# EAGLE design AccelRecorder (EAGLE 6.5.0)

## Sheet 1 of 2
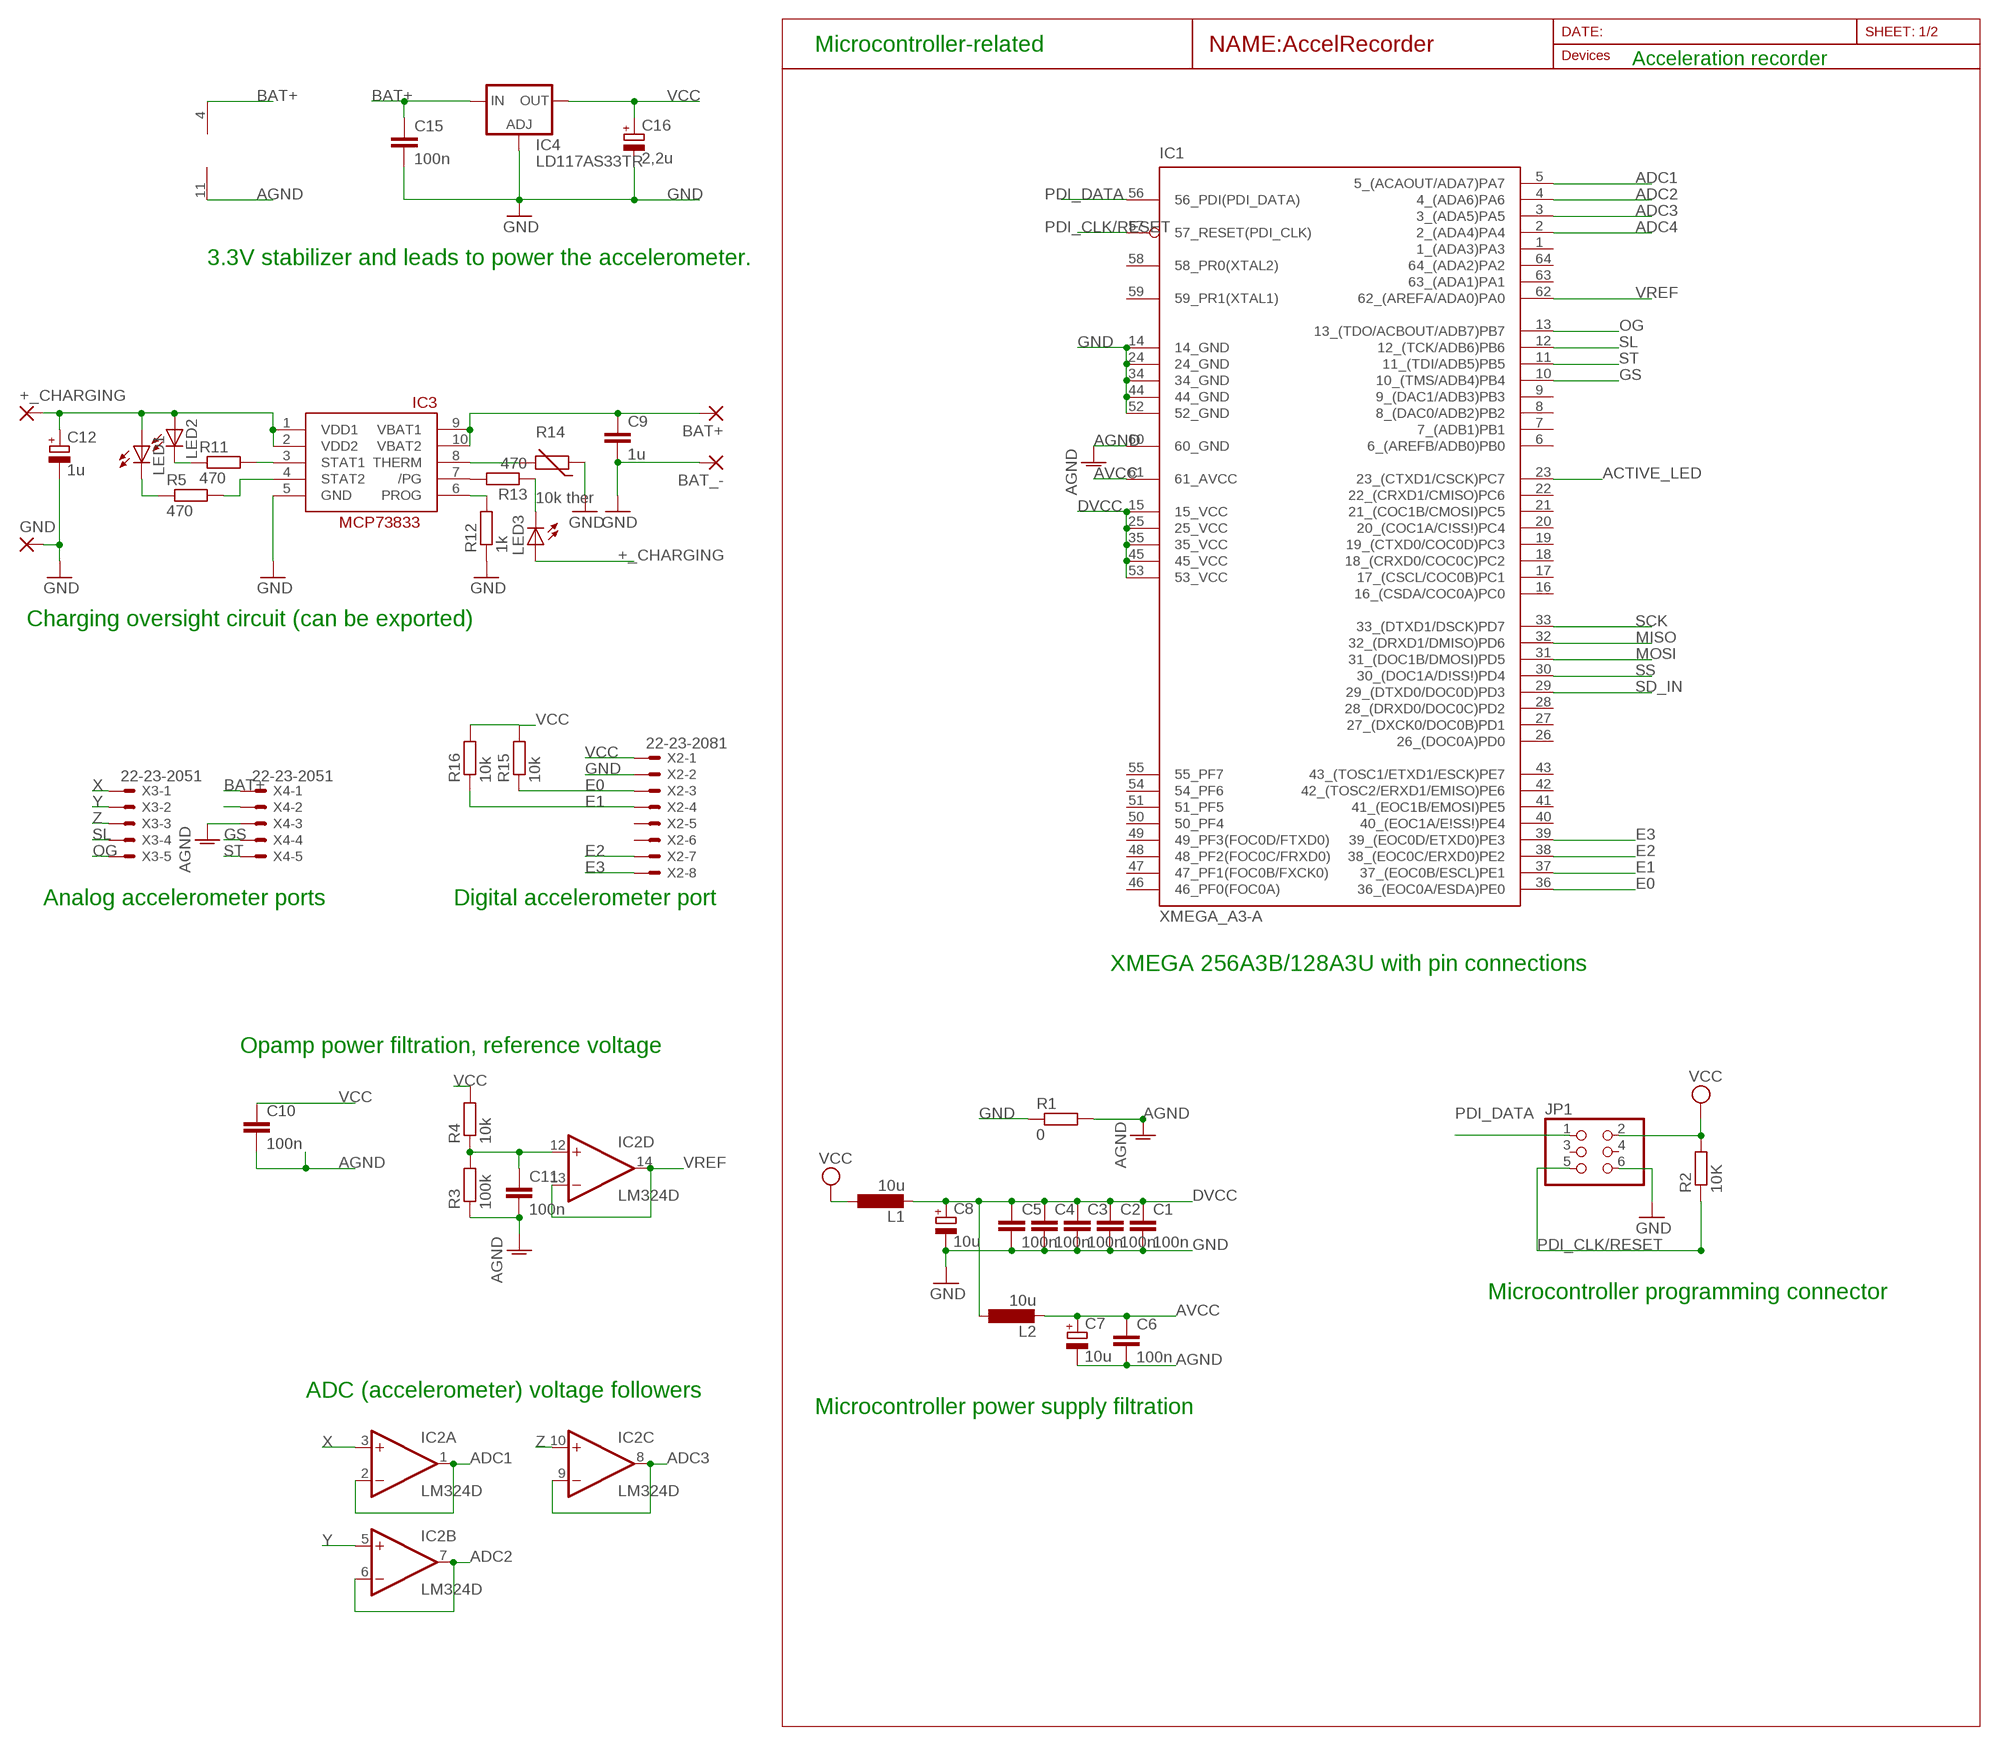
[diagram p0: schematic, sheet 1]

### Parts
+_CHARGING  SMD2  [SMD1,27-2,54]
BAT+  SMD2  [SMD1,27-2,54]
BAT_-  SMD2  [SMD1,27-2,54]
C1  100n  C-EUC0805K  [C0805K]
C2  100n  C-EUC0805K  [C0805K]
C3  100n  C-EUC0805K  [C0805K]
C4  100n  C-EUC0805K  [C0805K]
C5  100n  C-EUC0805K  [C0805K]
C6  100n  C-EUC0805K  [C0805K]
C7  10u  CPOL-EUSANYO_SMD_B6  [SANYO-OSCON_SMD_B6]
C8  10u  CPOL-EUSANYO_SMD_B6  [SANYO-OSCON_SMD_B6]
C9  1u  C-EUC1206  [C1206]
C10  100n  C-EUC0805  [C0805]
C11  100n  C-EUC0805  [C0805]
C12  1u  CPOL-EUSANYO_SMD_B6  [SANYO-OSCON_SMD_B6]
C15  100n  C-EUC0805K  [C0805K]
C16  2,2u  CPOL-EUSANYO_SMD_B6  [SANYO-OSCON_SMD_B6]
GND  SMD2  [SMD1,27-2,54]
IC1  XMEGA_A3-A  [TQFP64]
IC2  LM324D  [SO14]
IC3  MCP73833-UN  [MSOP10]
IC4  LD117AS33TR  [SOT223]
JP1  PINHD-2X3  [2X03]
L1  10u  L-EUL3225M  [L3225M]
L2  10u  L-EUL3225M  [L3225M]
LED1  LED3MM  [LED3MM]
LED2  LED3MM  [LED3MM]
LED3  LED3MM  [LED3MM]
R1  0  R-EU_M1206  [M1206]
R2  10K  R-EU_M1206  [M1206]
R3  100k  R-EU_M1206  [M1206]
R4  10k  R-EU_M1206  [M1206]
R5  470  R-EU_R0805  [R0805]
R11  470  R-EU_R0805  [R0805]
R12  1k  R-EU_R0805  [R0805]
R13  470  R-EU_R0805  [R0805]
R14  10k ther  THERMISTOR-2,5  [RS-2,5]
R15  10k  R-EU_M1206  [M1206]
R16  10k  R-EU_M1206  [M1206]
X2  22-23-2081  [22-23-2081]
X3  22-23-2051  [22-23-2051]
X4  22-23-2051  [22-23-2051]

### Nets
+_CHARGING: +_CHARGING.1(P) C12.+ IC3.1(VDD1) IC3.2(VDD2) LED1.A LED2.A LED3.A
ACTIVE_LED: IC1.23(23_(CTXD1/CSCK)PC7) ; also sheet 2
ADC1: IC1.5(5_(ACAOUT/ADA7)PA7) IC2.1(A:OUT) IC2.2(A:-IN)
ADC2: IC1.4(4_(ADA6)PA6) IC2.6(B:-IN) IC2.7(B:OUT)
ADC3: IC1.3(3_(ADA5)PA5) IC2.8(C:OUT) IC2.9(C:-IN)
ADC4: IC1.2(2_(ADA4)PA4)
AGND: C6.2 C7.- C10.2 C11.2 IC1.60(60_GND) IC2.11(P:V-) R1.2 R3.1 X4.3
AVCC: C6.1 C7.+ IC1.61(61_AVCC) L2.2
BAT+: BAT+.1(P) C9.1 C15.1 IC2.4(P:V+) IC3.9(VBAT1) IC3.10(VBAT2) IC4.3(IN) X4.1
DVCC: C1.1 C2.1 C3.1 C4.1 C5.1 C8.+ IC1.15(15_VCC) IC1.25(25_VCC) IC1.35(35_VCC) IC1.45(45_VCC) IC1.53(53_VCC) L1.2 L2.1
E0: IC1.36(36_(EOC0A/ESDA)PE0) R15.1 X2.3
E1: IC1.37(37_(EOC0B/ESCL)PE1) R16.1 X2.4
E2: IC1.38(38_(EOC0C/ERXD0)PE2) X2.7
E3: IC1.39(39_(EOC0D/ETXD0)PE3) X2.8
GND: BAT_-.1(P) C1.2 C2.2 C3.2 C4.2 C5.2 C8.- C9.2 C12.- C15.2 C16.- GND.1(P) IC1.14(14_GND) IC1.24(24_GND) IC1.34(34_GND) IC1.44(44_GND) IC1.52(52_GND) IC3.5(GND) IC4.1(ADJ) JP1.6 R1.1 R12.1 R14.1 X2.2 ; also sheet 2
GS: IC1.10(10_(TMS/ADB4)PB4) X4.4
MISO: IC1.32(32_(DRXD1/DMISO)PD6) ; also sheet 2
MOSI: IC1.31(31_(DOC1B/DMOSI)PD5) ; also sheet 2
N$3: IC3.7(/PG) R13.2
N$6: LED3.K(C) R13.1
N$7: IC3.3(STAT1) R11.2
N$8: LED2.K(C) R11.1
N$9: C11.1 IC2.12(D:+IN) R3.2 R4.1
N$10: IC3.6(PROG) R12.2
N$11: IC3.8(THERM) R14.2
N$12: LED1.K(C) R5.1
N$13: IC3.4(STAT2) R5.2
N$17: X4.2
OG: IC1.13(13_(TDO/ACBOUT/ADB7)PB7) X3.5
PDI_CLK/RESET: IC1.57(57_RESET(PDI_CLK)) JP1.5 R2.1
PDI_DATA: IC1.56(56_PDI(PDI_DATA)) JP1.1
SCK: IC1.33(33_(DTXD1/DSCK)PD7) ; also sheet 2
SD_IN: IC1.29(29_(DTXD0/DOC0D)PD3) ; also sheet 2
SL: IC1.12(12_(TCK/ADB6)PB6) X3.4
SS: IC1.30(30_(DOC1A/D\!SS\!)PD4) ; also sheet 2
ST: IC1.11(11_(TDI/ADB5)PB5) X4.5
VCC: C10.1 C16.+ IC4.4(OUT) JP1.2 L1.1 R2.2 R4.2 R15.2 R16.2 X2.1 ; also sheet 2
VREF: IC1.62(62_(AREFA/ADA0)PA0) IC2.13(D:-IN) IC2.14(D:OUT)
X: IC2.3(A:+IN) X3.1
Y: IC2.5(B:+IN) X3.2
Z: IC2.10(C:+IN) X3.3
Unconnected: IC1.1(1_(ADA3)PA3) IC1.6(6_(AREFB/ADB0)PB0) IC1.7(7_(ADB1)PB1) IC1.8(8_(DAC0/ADB2)PB2) IC1.9(9_(DAC1/ADB3)PB3) IC1.16(16_(CSDA/COC0A)PC0) IC1.17(17_(CSCL/COC0B)PC1) IC1.18(18_(CRXD0/COC0C)PC2) IC1.19(19_(CTXD0/COC0D)PC3) IC1.20(20_(COC1A/C\!SS\!)PC4) IC1.21(21_(COC1B/CMOSI)PC5) IC1.22(22_(CRXD1/CMISO)PC6) IC1.26(26_(DOC0A)PD0) IC1.27(27_(DXCK0/DOC0B)PD1) IC1.28(28_(DRXD0/DOC0C)PD2) IC1.40(40_(EOC1A/E\!SS\!)PE4) IC1.41(41_(EOC1B/EMOSI)PE5) IC1.42(42_(TOSC2/ERXD1/EMISO)PE6) IC1.43(43_(TOSC1/ETXD1/ESCK)PE7) IC1.46(46_PF0(FOC0A)) IC1.47(47_PF1(FOC0B/FXCK0)) IC1.48(48_PF2(FOC0C/FRXD0)) IC1.49(49_PF3(FOC0D/FTXD0)) IC1.50(50_PF4) IC1.51(51_PF5) IC1.54(54_PF6) IC1.55(55_PF7) IC1.58(58_PR0(XTAL2)) IC1.59(59_PR1(XTAL1)) IC1.63(63_(ADA1)PA1) IC1.64(64_(ADA2)PA2) JP1.3 JP1.4 X2.5 X2.6

### Notes on the sheet
- Microcontroller-related
- Acceleration recorder
- 3.3V stabilizer and leads to power the accelerometer.
- Charging oversight circuit (can be exported)
- Analog accelerometer ports | Digital accelerometer port
- XMEGA 256A3B/128A3U with pin connections
- Opamp power filtration, reference voltage
- Microcontroller programming connector
- ADC (accelerometer) voltage followers
- Microcontroller power supply filtration

## Sheet 2 of 2
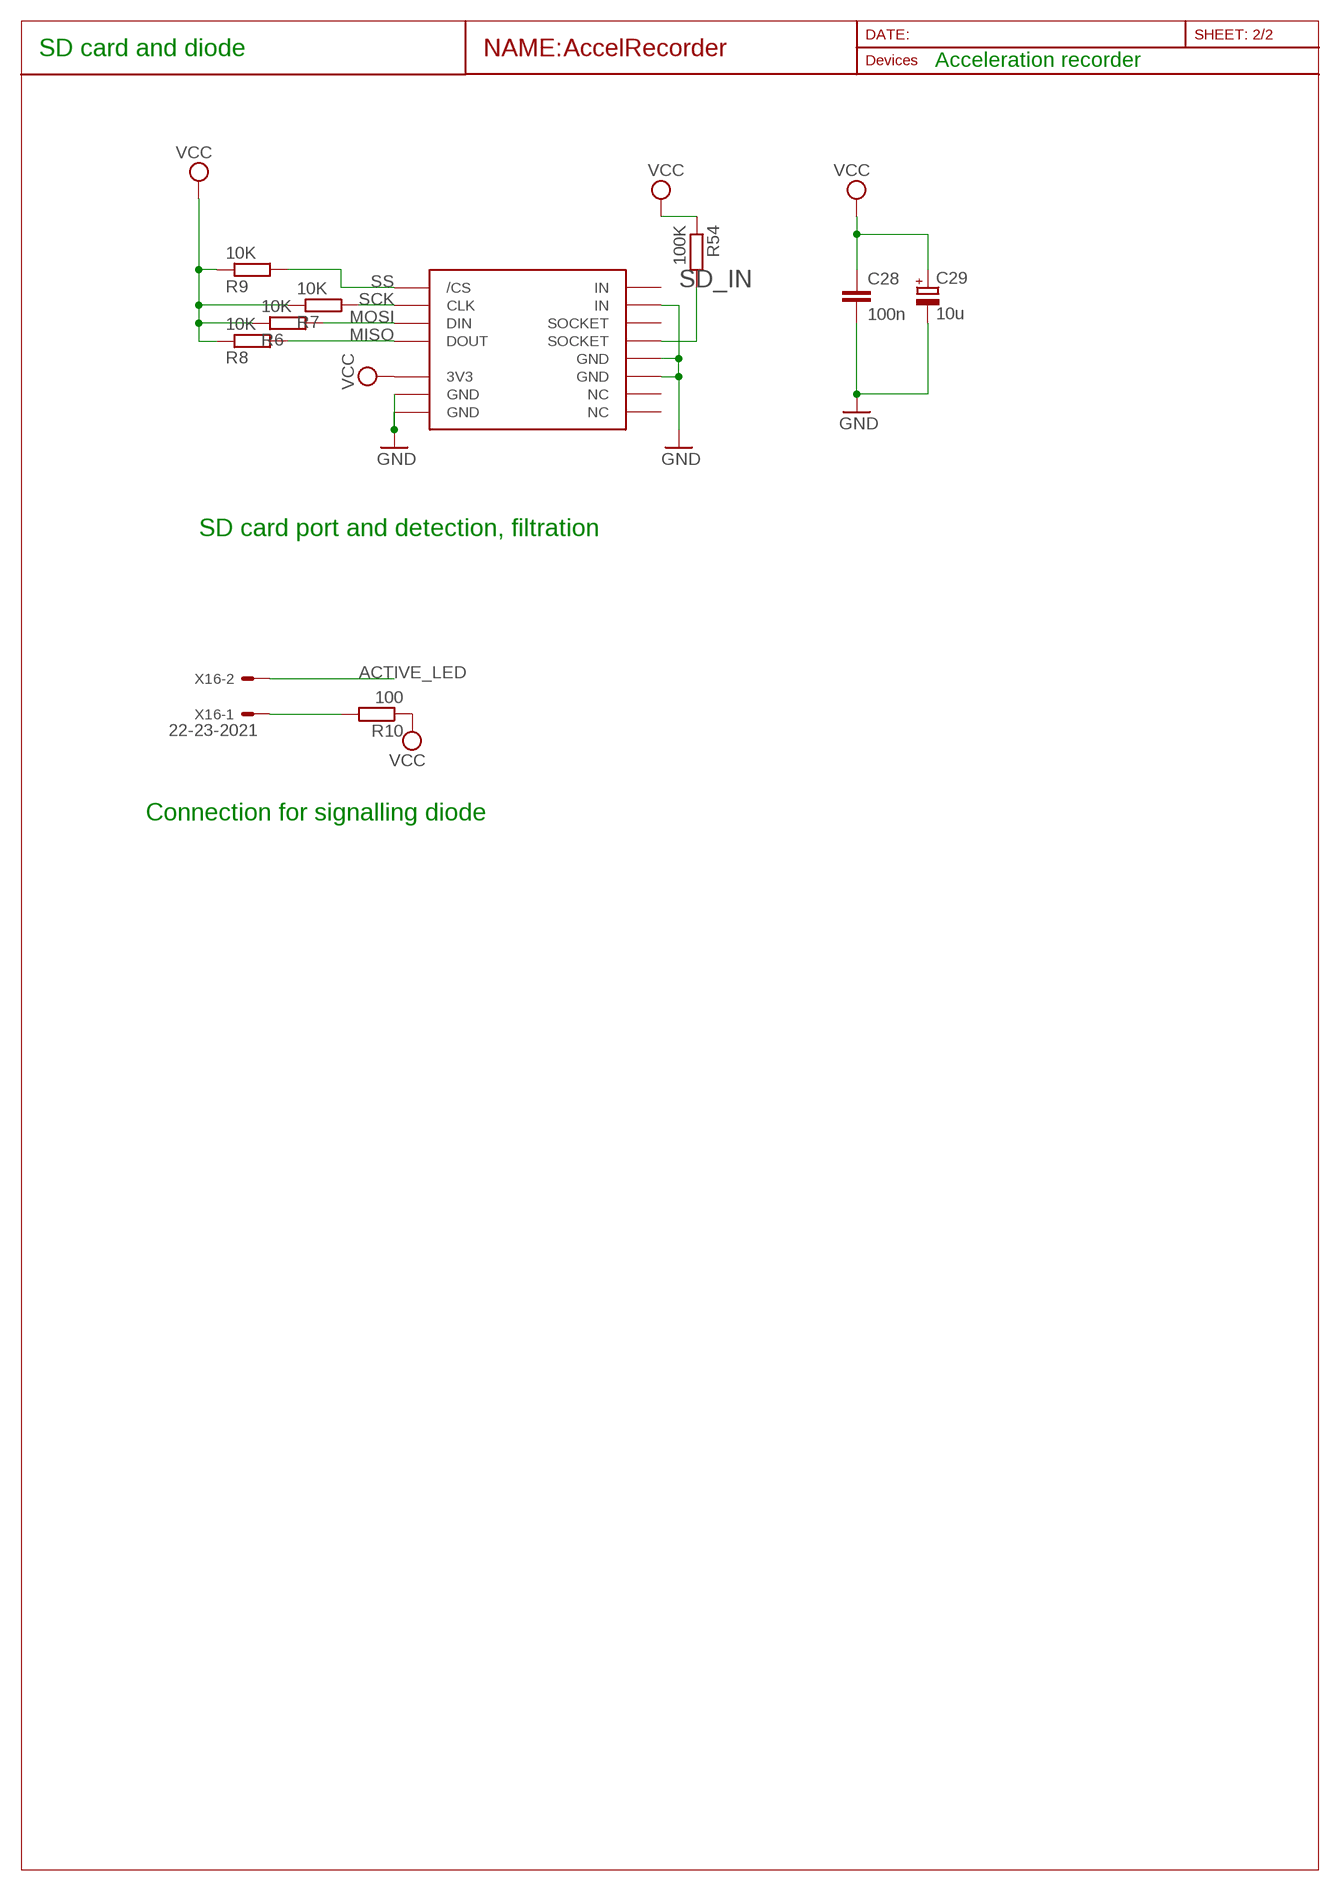
[diagram p1: schematic, sheet 2]

### Parts
C28  100n  C-EUC0805K  [C0805K]
C29  10u  CPOL-EUSANYO_SMD_B6  [SANYO-OSCON_SMD_B6]
R6  10K  R-EU_M1206  [M1206]
R7  10K  R-EU_M1206  [M1206]
R8  10K  R-EU_M1206  [M1206]
R9  10K  R-EU_M1206  [M1206]
R10  100  R-EU_M1206  [M1206]
R54  100K  R-EU_M1206  [M1206]
U$1  MMC  [MMC_SOCKET]
X16  22-23-2021  [22-23-2021]

### Nets
ACTIVE_LED: X16.2 ; also sheet 1
GND: C28.2 C29.- U$1.GND@1(GND) U$1.GND@2(GND) U$1.GND@3(GND) U$1.GND@4(GND) U$1.IN@2(IN) ; also sheet 1
MISO: R8.2 U$1.DOUT ; also sheet 1
MOSI: R6.2 U$1.DIN ; also sheet 1
N$4: R10.2 X16.1
SCK: R7.2 U$1.CLK ; also sheet 1
SD_IN: R54.2 U$1.P$2(SOCKET) ; also sheet 1
SS: R9.2 U$1./CS ; also sheet 1
VCC: C28.1 C29.+ R6.1 R7.1 R8.1 R9.1 R10.1 R54.1 U$1.3V3 ; also sheet 1
Unconnected: U$1.IN@1(IN) U$1.NC@1(NC) U$1.NC@2(NC) U$1.P$1(SOCKET)

### Notes on the sheet
- SD card and diode
- Acceleration recorder
- SD card port and detection, filtration
- Connection for signalling diode

## Library data of the parts
+_CHARGING BAT+ BAT_- GND = wirepad:SMD2: SMD PAD
C1-C6 C9-C11 C15 C28 = rcl:C-EU: CAPACITOR, European symbol
C7 C8 C12 C16 C29 = rcl:CPOL-EU: POLARIZED CAPACITOR, European symbol
IC1 = xmega_a3:XMEGA_A3: MICROCONTROLLER 64-256 Kbytes FLASH 4-16 Kbytes SRAM 2-4 Kbytes EEPROM DMA Controller and Event System 2 8-channel 12 bit ADC, 1 2-channel 12bit DAC 7 USART, 2 TWI, 3 SPI AES and DES Crypto Engine Source: xmega_a3.lbr
IC2 = linear:LM324: OP AMP
IC3 = adafruit:MCP73833
IC4 = v-reg:LD117A?*: Low drop fixed and adjustable positive voltage regulators 1 A Source: http://www.st.com/stonline/products/literature/ds/7194/ld1117axx.pdf
JP1 = pinhead:PINHD-2X3: PIN HEADER
L1 L2 = rcl:L-EU: INDUCTOR, European symbol
LED1-LED3 = SparkFunEagle-6-6-07:LED: LEDs Standard schematic elements and footprints for 5mm, 3mm, 1206, and 0603 sized LEDs. 5mm - Spark Fun Electronics SKU : COM-00529 (and others)
R1-R4 R6-R10 R15 R16 R54 = resistor:R-EU_: RESISTOR, European symbol
R5 R11-R13 = rcl:R-EU_: RESISTOR, European symbol
R14 = varistor:THERMISTOR: THERMISTOR
U$1 = SD:MMC
X2 = con-molex:22-23-2081: .100" (2.54mm) Center Header - 8 Pin; MF: MOLEX; MPN: 22-23-2081; OC_FARNELL: 1756826; OC_NEWARK: 01C7592
X3 X4 = con-molex:22-23-2051: .100" (2.54mm) Center Header - 5 Pin; MF: MOLEX; MPN: 22-23-2051; OC_FARNELL: 1462952; OC_NEWARK: 38C9178
X16 = con-molex:22-23-2021: .100" (2.54mm) Center Header - 2 Pin; MF: MOLEX; MPN: 22-23-2021; OC_FARNELL: 1462926; OC_NEWARK: 25C3832

## Net classes
0 default: width 0.013 mm, drill 1 mm

## Board
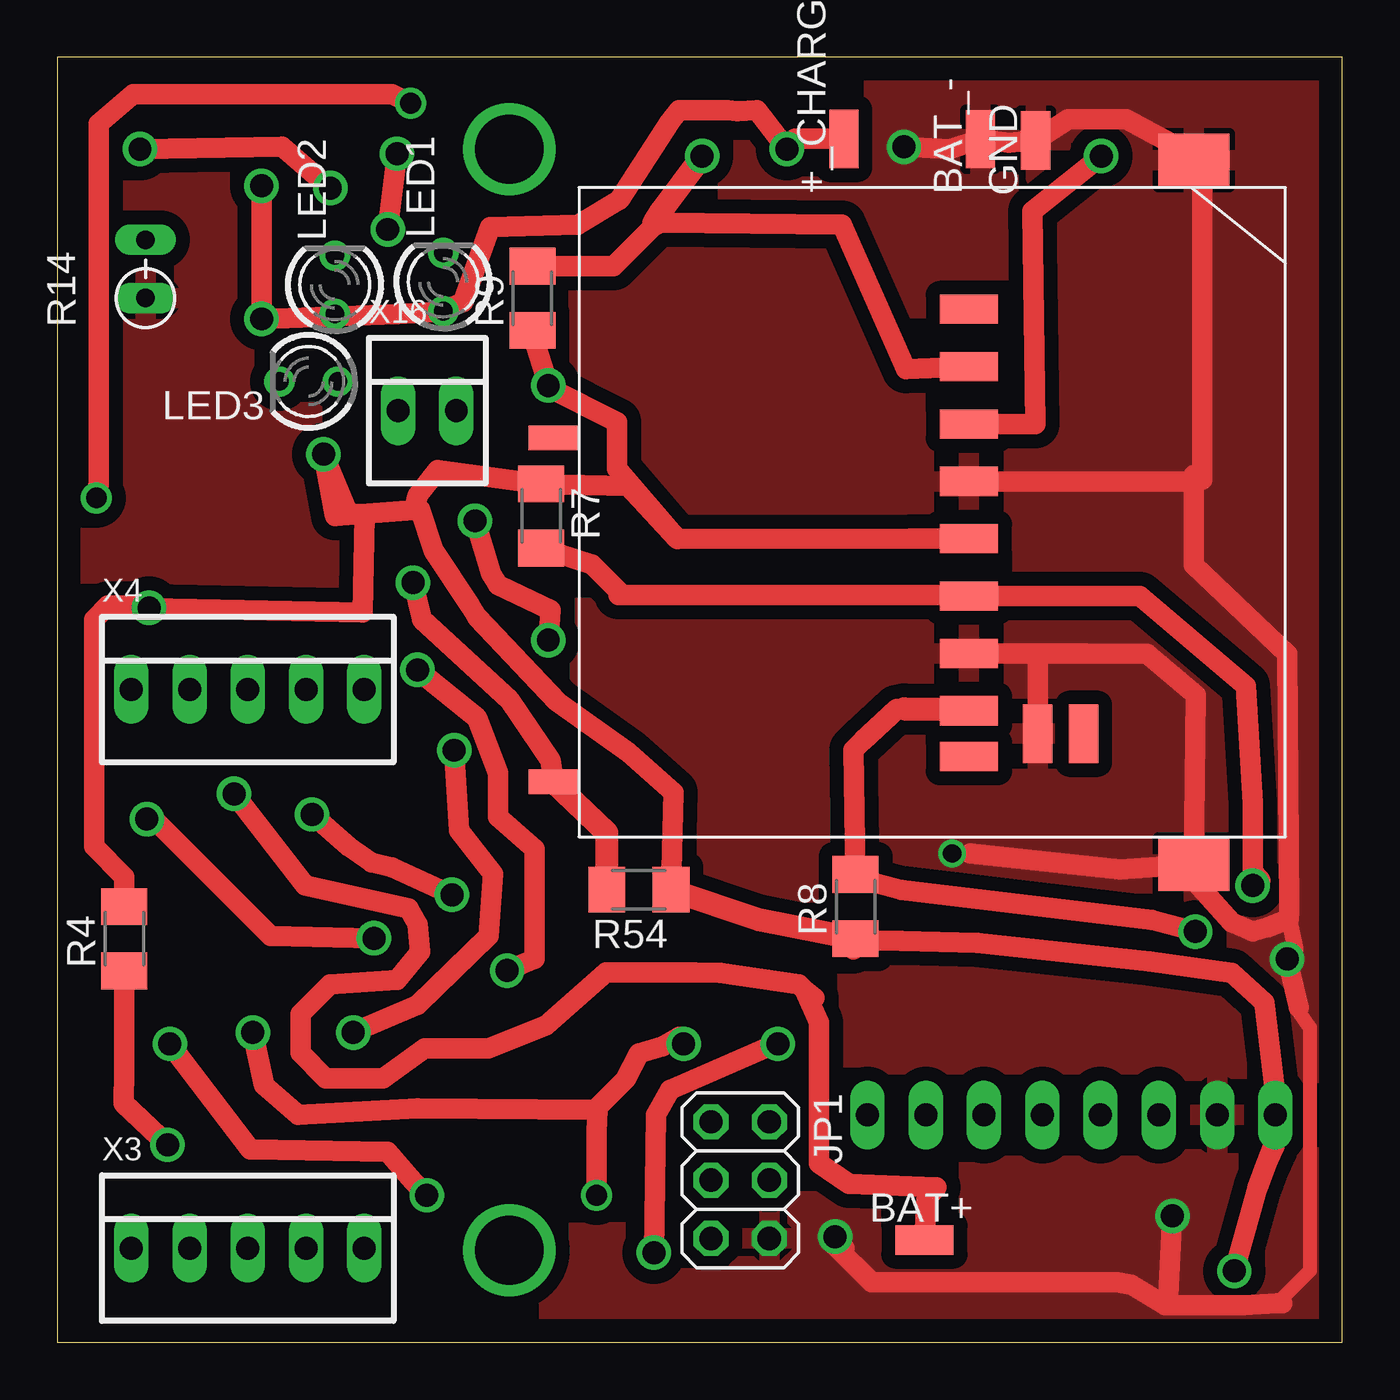
[diagram p2: board, top side]
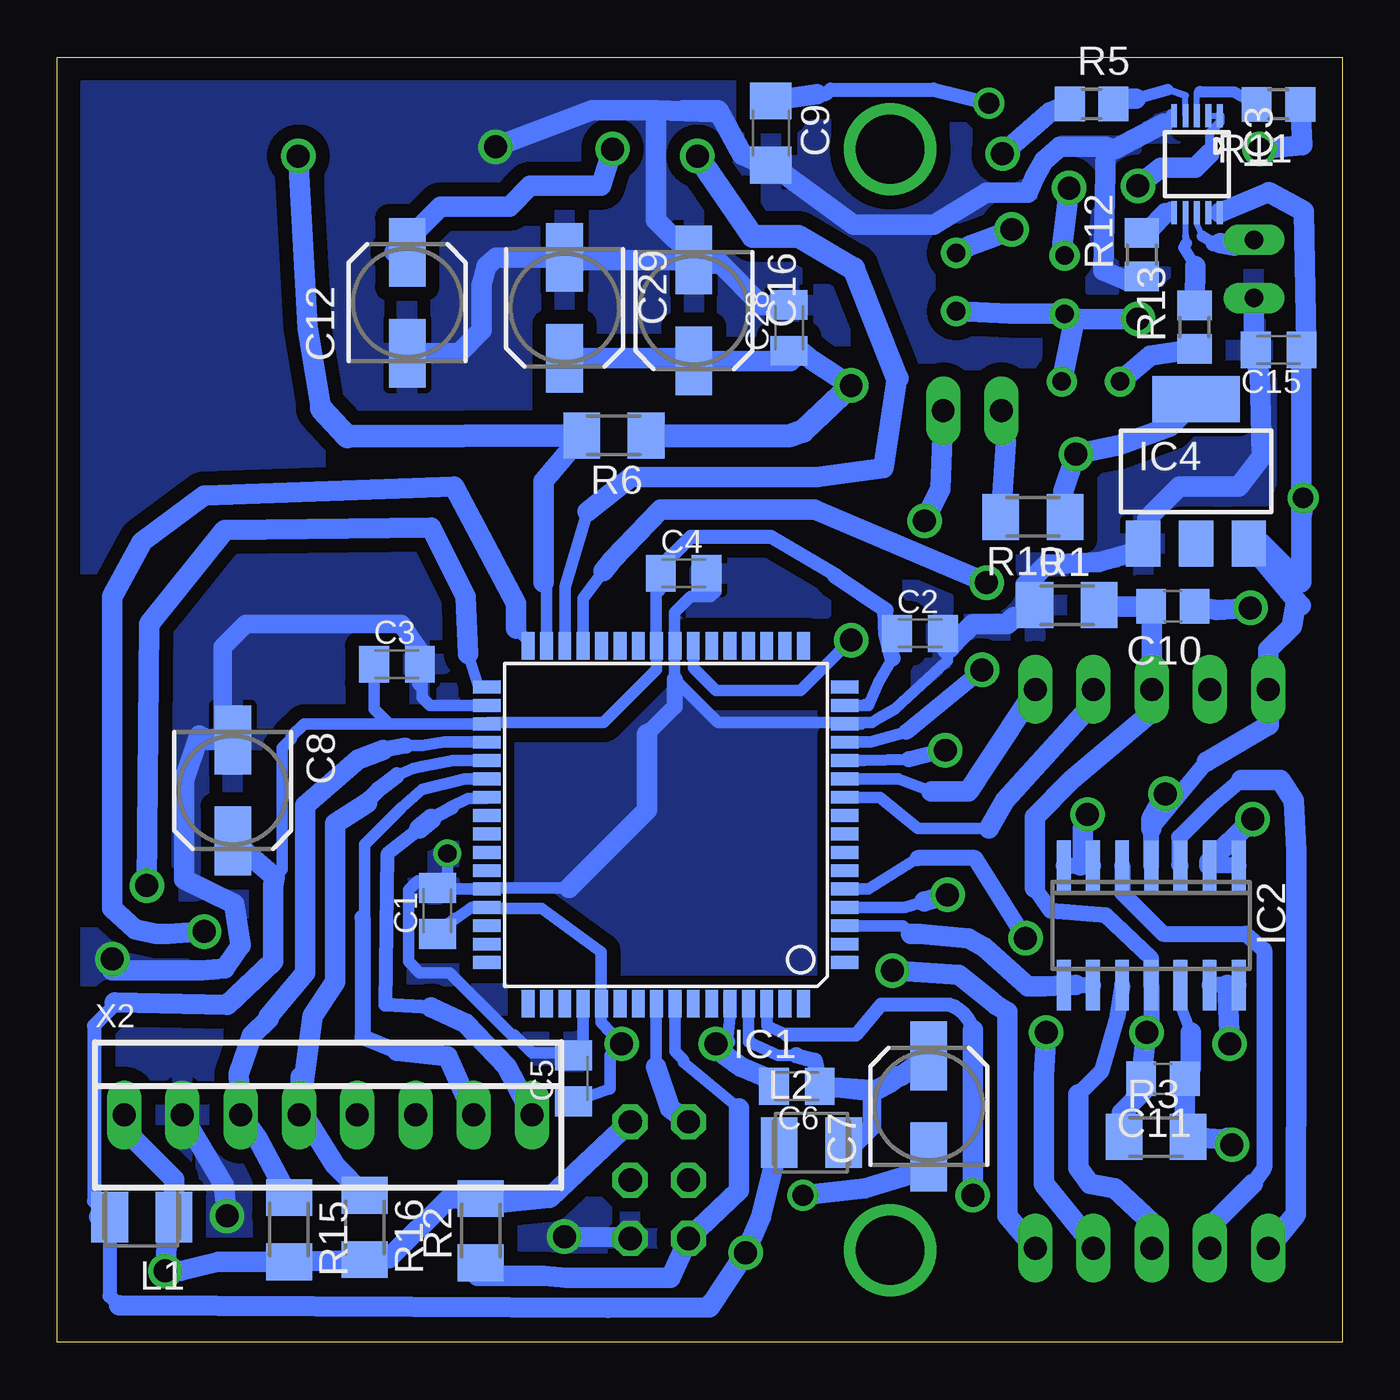
[diagram p3: board, bottom side, seen from below]

Size 56 x 56 mm. Coordinates in mm from the lower left corner, seen from the top.
Outline: 0,0 56,0 56,56 0,56 0,0
Copper layers (1*16): Top 0.035mm / dielectric 1.5mm / Bottom 0.035mm
Design rules "default *": minimum track width 8mil, minimum drill 1mm, track to track 8mil, track to pad 8mil, pad to pad 8mil, via to via 8mil, smd to smd 8mil, copper to edge 40mil, drill to drill 8mil, minimum pad ring 10mil, minimum via ring 8mil, stop-mask expansion 4mil, vias tented up to drill 0mil, thermal gap 10mil

### Footprints (pad centres in the part's own frame; a part is rotated, then mirrored left to right if it is on the bottom)
SMD1,27-2,54 = smd 1.27 x 2.54: 1 0,0
C0805K = smd 1.3 x 1.6: 1 -1,0; 2 1,0
SANYO-OSCON_SMD_B6 = smd 3 x 1.6: + 2.2,0; - -2.2,0
C1206 = smd 1.6 x 1.8: 1 -1.4,0; 2 1.4,0
C0805 = smd 1.3 x 1.5: 1 -0.95,0; 2 0.95,0
TQFP64 = smd 1.194 x 0.559: 1 -7.8,6; 2 -7.8,5.2; 3 -7.8,4.4; 4 -7.8,3.6; 5 -7.8,2.8; 6 -7.8,2; 7 -7.8,1.2; 8 -7.8,0.4; 9 -7.8,-0.4; 10 -7.8,-1.2; 11 -7.8,-2; 12 -7.8,-2.8; 13 -7.8,-3.6; 14 -7.8,-4.4; 15 -7.8,-5.2; 16 -7.8,-6; 33 7.8,-6; 34 7.8,-5.2; 35 7.8,-4.4; 36 7.8,-3.6; 37 7.8,-2.8; 38 7.8,-2; 39 7.8,-1.2; 40 7.8,-0.4; 41 7.8,0.4; 42 7.8,1.2; 43 7.8,2; 44 7.8,2.8; 45 7.8,3.6; 46 7.8,4.4; 47 7.8,5.2; 48 7.8,6 | smd 0.559 x 1.194: 17 -6,-7.8; 18 -5.2,-7.8; 19 -4.4,-7.8; 20 -3.6,-7.8; 21 -2.8,-7.8; 22 -2,-7.8; 23 -1.2,-7.8; 24 -0.4,-7.8; 25 0.4,-7.8; 26 1.2,-7.8; 27 2,-7.8; 28 2.8,-7.8; 29 3.6,-7.8; 30 4.4,-7.8; 31 5.2,-7.8; 32 6,-7.8; 49 6,7.8; 50 5.2,7.8; 51 4.4,7.8; 52 3.6,7.8; 53 2.8,7.8; 54 2,7.8; 55 1.2,7.8; 56 0.4,7.8; 57 -0.4,7.8; 58 -1.2,7.8; 59 -2,7.8; 60 -2.8,7.8; 61 -3.6,7.8; 62 -4.4,7.8; 63 -5.2,7.8; 64 -6,7.8
SO14 = smd 0.6 x 2.2: 1 -3.81,-2.6; 2 -2.54,-2.6; 3 -1.27,-2.6; 4 0,-2.6; 5 1.27,-2.6; 6 2.54,-2.6; 7 3.81,-2.6; 8 3.81,2.6; 9 2.54,2.6; 10 1.27,2.6; 11 0,2.6; 12 -1.27,2.6; 13 -2.54,2.6; 14 -3.81,2.6
MSOP10 = smd 0.25 x 1: 1 -1,-2.113; 2 -0.5,-2.113; 3 0,-2.113; 4 0.5,-2.113; 5 1,-2.113; 6 1,2.113; 7 0.5,2.113; 8 0,2.113; 9 -0.5,2.113; 10 -1,2.113
SOT223 = smd 1.5 x 2: 1 -2.3,-3.15; 2 0,-3.15; 3 2.3,-3.15 | smd 3.8 x 2: 4 0,3.15
2X03 = drill 1.016 octagon: 1 -2.54,-1.27; 2 -2.54,1.27; 3 0,-1.27; 4 0,1.27; 5 2.54,-1.27; 6 2.54,1.27
L3225M = smd 1.6 x 2.2: 1 -1.4,0; 2 1.4,0
LED3MM = drill 0.813: A -1.27,0; K 1.27,0
M1206 = smd 1.6 x 2: 1 -1.4,0; 2 1.4,0
R0805 = smd 1.3 x 1.5: 1 -0.95,0; 2 0.95,0
RS-2,5 = drill 0.813 long: 1 -1.27,0; 2 1.27,0
MMC_SOCKET = smd 1.27 x 2.54: 3V3 1.5,4; /CS -6,4; CLK 4,4; DIN -3.5,4; DOUT 9,4; GND@1 -1,4; GND@2 6.5,4; NC@1 -8.5,4; NC@2 11,4 | smd 2.3 x 3.1: GND@3 15.7,13.8; GND@4 -15,13.8 | smd 2.54 x 1.27: IN@1 10,9; IN@2 10,7 | smd 1.067 x 2.184: P$1 -2.9,-14.1; P$2 12.1,-14.1
22-23-2081 = drill 1 long: 1 -8.89,0; 2 -6.35,0; 3 -3.81,0; 4 -1.27,0; 5 1.27,0; 6 3.81,0; 7 6.35,0; 8 8.89,0
22-23-2051 = drill 1 long: 1 -5.08,0; 2 -2.54,0; 3 0,0; 4 2.54,0; 5 5.08,0
22-23-2021 = drill 1 long: 1 -1.27,0; 2 1.27,0

### Placement (x,y rotation side)
+_CHARGING  34.28,52.45 0 top
BAT+  37.79,4.45 270 top
BAT_-  40.23,52.43 0 top
C1  39.43,18.8 90 bottom
C2  18.4,30.89 0 bottom
C3  41.2,29.55 0 bottom
C4  28.7,33.51 0 bottom
C5  33.5,11.5 90 bottom
C6  23.77,11.15 180 bottom
C7  18.02,10.28 90 bottom
C8  48.35,24.05 270 bottom
C9  24.9,52.7 270 bottom
C10  7.38,32.07 180 bottom
C11  7.81,11.48 180 bottom
C12  40.75,45.3 90 bottom
C15  2.77,43.25 180 bottom
C16  28.26,44.97 270 bottom
C28  24.11,44.21 90 bottom
C29  33.89,45.08 270 bottom
GND  42.64,52.38 0 top
IC1  29.48,22.55 180 bottom
IC2  8.32,18.17 180 bottom
IC3  6.33,51.34 180 bottom
IC4  6.37,37.95 0 bottom
JP1  29.76,7.06 270 top
L1  52.32,5.46 180 bottom
L2  23.13,8.7 0 bottom
LED1  16.82,46.21 90 top
LED2  12.09,46.09 90 top
LED3  10.95,41.87 180 top
R1  11.99,32.12 0 bottom
R2  37.55,4.86 90 bottom
R3  8.11,8.94 0 bottom
R4  2.92,17.58 90 top
R5  10.92,53.97 0 bottom
R6  31.74,39.52 180 bottom
R7  21.09,36.01 270 top
R8  34.79,18.99 90 top
R9  20.71,45.5 90 top
R10  13.48,35.97 180 bottom
R11  2.78,53.95 180 bottom
R12  8.73,47.4 90 bottom
R13  6.44,44.24 90 bottom
R14  3.84,46.78 90 top
R15  45.9,4.9 270 bottom
R16  42.6,5 270 bottom
R54  25.35,19.72 180 top
U$1  35.73,36.52 270 top
X2  44.2,9.9 0 bottom
X3  8.3,4.1 0 top
X4  8.3,28.45 0 top
X16  16.12,40.6 0 top

### Tracks (layer width: path | path; a pad name or v marks a point on that pad's centre or on a via)
+_CHARGING  (via drill 1)
  Top 0.9: v8.9,50.4 v8.9,44.6 14.8,44.8 16.72,44.92 17.68,45.32 18.86,48.6 22.7,48.7 24.5,49.8 26.7,53.2 27.1,53.7 29.2,53.7 29.65,53.65 30.5,53.7 v31.8,52 32.15,52.45 +_CHARGING.1
  Bottom 0.27: IC3.2 IC3.1
  Bottom 0.4: IC3.1 5.33,53.17 5.8,52.7 5.8,51.8
  Bottom 0.9: 5.8,51.8 6.4,51.2 7.9,51.2 v8.9,50.4 | v8.9,44.6 11.47,44.6 | 11.47,44.6 LED2.A 14.48,44.82 LED1.A | LED3.A 11.72,44.35 11.47,44.6 | C12.+ 41.3,47.5 39.3,49.5 36.3,49.5 35.4,50.4 32.3,50.4 v31.8,52
ACTIVE_LED  (via drill 1)
  Top 0.9: v21.4,30.6 21.5,31.9 19.2,33 18.9,33.5 v18.2,35.8
  Bottom 0.5: IC1.23 28.28,29.38 27.3,28.4 23.6,28.4 v21.4,30.6
  Bottom 0.9: v18.2,35.8 17.5,37.19 X16.2
ADC1  (via drill 1)
  Top 0.9: v3.9,22.8 4.2,22.8 9.3,17.7 v13.8,17.6
  Bottom 0.5: IC1.5 20.65,19.75 18.5,21.1
  Bottom 0.7: IC2.1 IC2.2 | v13.8,17.6 16,21.1 18.5,21.1
  Bottom 0.9: IC2.2 5.78,20.92 v3.9,22.8
ADC2  (via drill 1)
  Top 0.9: v17.2,19.5 14.6,20.7 13.7,20.9 12.7,21.6 v11.1,23
  Bottom 0.5: IC1.4 19.05,18.95 18.2,19.2
  Bottom 0.7: IC2.7 11.4,20.77 IC2.6
  Bottom 0.9: 18.2,19.2 v17.2,19.5 | v11.1,23 11.3,22.4 11.3,20.87 11.4,20.77
ADC3
  Bottom 0.5: IC1.3 19.15,18.15 18.8,17.8
  Bottom 0.7: IC2.8 11.6,15.57 IC2.9
  Bottom 0.9: 11.6,15.57 12.97,15.5 13.7,15.5 15.6,17.2 16.3,17.6 18.4,17.8 18.8,17.8
AGND  (via drill 0.9, 1)
  Top 0.9: v8.52,13.5 9.02,11.2 10.5,9.9 15.7,10.2 23.54,10.13 | v27.3,13 27.1,13.3 26.38,12.9 25.36,12.58 24.76,11.46 23.6,10.3 23.5,10.2 23.54,10.13 | v23.5,6.4 23.5,9.19 23.54,10.13
  Bottom 0.5: IC1.60 26.68,14.18 26.8,13.1
  Bottom 0.7: 13.4,19.8 12.7,18.8 10.3,18.6 8.32,16.72 IC2.11 8.32,13.7 | 26.8,13.1 27.1,12.8 v27.3,13 27.1,13.2
  Bottom 0.9: 13.4,19.8 13.4,22.9 11.8,24.5 8.6,27.2 X4.3 8.3,31.3 C10.2 10.54,32.07 R1.2 | 8.32,13.7 v8.52,13.5 8.56,13.36 C11.2 8.76,10.96 8.7,10.9 9.61,9.99 R3.1 | v27.3,13 27.6,13 26.2,12 25.02,11.5 C6.2 | C7.- 17.92,7.58 20.8,6.7 v23.5,6.4
AVCC
  Bottom 0.5: IC1.61 25.88,13.08 24.6,12.5 23.8,12.5
  Bottom 0.7: 23.8,12.5 23,12.28 C6.1
  Bottom 0.813: L2.2 21.2,8.7 20.5,9.4 20.5,10.88 C6.1
  Bottom 0.9: C6.1 20.52,11 20.3,11 19.7,11.3 19.3,11.6 19.2,11.6 C7.+ | L2.2 21.6,8.6 21.9,8.8
BAT+  (via drill 0.9, 1)
  Top 0.9: v7.7,23.9 10.8,19.9 15.3,18.9 15.7,18.2 15.8,17 14.8,15.8 11.9,15.6 10.6,14.3 10.6,12.6 11.7,11.5 14.2,11.5 16,12.8 18.8,12.8 21.3,13.8 23.91,16.11 27.79,16.11 28.9,16.1 32.33,15.6 32.57,15.36 | 32.57,15.36 32.99,15.01 | 32.57,15.36 33.2,13.93 33.2,7.8 34.5,6.9 38.32,6.76 37.89,6.23 BAT+.1 | v15.4,54 14.6,54.4 3.3,54.4 1.8,53.1 1.8,37.4 v1.7,36.8
  Bottom 0.3: IC3.9 IC3.10
  Bottom 0.61: 22.9,54.4 22.5,54.4 22.3,54.6 17.8,54.6 v15.4,54
  Bottom 0.7: IC2.4 8.32,22.38 5.9,25.3
  Bottom 0.9: 5.9,25.3 3.2,26.9 3.2,28.43 X4.1 3.22,30.18 2.2,31.2 2,32.3 | 8.32,22.38 8.32,22.78 v7.7,23.9 | 2,32.3 2,32.33 IC4.3 3.5,34.8 1.8,33.1 1.77,33.13 1.77,36 | IC3.10 3.21,50.13 1.67,49.29 1.57,43.55 C15.1 | 1.6,43.22 C15.1 | 1.8,32.1 2,32.3 | C9.1 22.9,54.4 | C15.1 1.77,36 | v1.7,36.8 1.7,36.47 1.77,36
DVCC  (via drill 1)
  Top 0.9: v31.4,13 31.3,13 26.7,11 26.1,9.9 v26,3.9
  Bottom 0.406: C2.1 19.86,30.89 19.86,30.8
  Bottom 0.5: 32.3,13.93 v31.4,13 31.9,12.5 31.9,11.03 C5.1 | 32.3,13.93 IC1.53 | 32.3,13.93 32.3,17 34.9,18.9 37.23,18.9 IC1.45 37.95,18.95 39,18.2 38.63,18.5 C1.1 | 20.8,27.8 20.85,27.75 IC1.15 20.65,27.75 20.2,28.8 19.6,29.8 | IC1.35 37.23,27 32.2,27 29.88,29.32 IC1.25 29.9,30.37 29.9,32.6 29.7,32.8 C4.1 | IC1.35 41.55,26.95 42.2,27.6 C3.1 | IC1.35 45.25,26.95 45.8,26.4 45.8,26.3 46.2,25.9 46.2,20.6 46.53,20.27
  Bottom 0.61: 22.1,33.4 22.2,33.5 24.9,35.1 28.4,35.1 29.3,34.2 C4.1 | 53.5,14.8 53.5,14.7 54.4,13.8 54.4,6.14 L1.2 53.72,2.02 53.3,1.6
  Bottom 0.7: 19.6,29.8 19.86,30.8 19.9,31.9 22.1,33.4
  Bottom 0.9: 27.58,1.52 27.52,1.7 27.6,1.6 | C8.+ 46.53,20.27 46.6,19.9 46.6,16.6 48.6,14.7 53.5,14.8 | 27.58,1.52 v26,3.9 25.33,5.47 L2.1 | 53.3,1.6 32,1.5 27.58,1.52 | L1.2 54.18,5.46
E0
  Bottom 0.5: IC1.36 39.15,26.15 40.1,26 40.8,26
  Bottom 0.7: 40.8,26 41.8,25.8
  Bottom 0.9: 41.8,25.8 42.9,25.4 45.2,23.4 45.2,16.1 46.8,14.2 46.8,14.1 47.5,13.4 48.1,11.69 X2.3 47.3,8.9 R15.1
E1
  Bottom 0.5: IC1.37 38.75,25.35 40.1,25.1 40.5,25 41.2,24.7
  Bottom 0.7: 41.2,24.7 42,24.1 42.4,23.7 42.4,23.6 42.5,23.5
  Bottom 0.9: 42.5,23.5 43.9,22.6 43.9,15.7 44.87,14.23 X2.4 45.4,11.57 45.2,9.8 43.9,7.7 R16.1
E2
  Bottom 0.5: IC1.38 38.25,24.55 40.1,24.1 41,23.3 42.6,21.7 42.6,18.6 42.7,18.5
  Bottom 0.7: 42.7,18.5 42.7,13.3 41.2,12.7
  Bottom 0.9: 41.2,12.7 39,12.45 X2.7
E3
  Bottom 0.5: 38.8,23.3 38.9,23.3 38.1,23.7 37.33,23.7 IC1.39
  Bottom 0.61: 39.7,14.6 41.7,14.7 41.6,21.3 40.2,22.4 | 39.7,22.8 38.8,23.3
  Bottom 0.9: X2.8 36.41,12.01 38.2,13.9 39.7,14.6 | 40.2,22.4 39.7,22.8
GND  (via drill 0.8, 1)
  Top 0.5: 39.8,21.3 39.3,21.4 v39,21.3
  Top 0.61: 54.1,14.6 54.1,14.4 54.6,13.7 54.6,3.12 53.17,1.69
  Top 0.7: 53.68,18.44 53.96,17.14 v53.6,16.7
  Top 0.9: 49.9,51.52 49.9,37.59 49.53,37.79 49.53,37.5 | 49.9,51.52 U$1.GND@4 | U$1.GND@1 39.93,37.5 49.53,37.5 | U$1.GND@2 42.6,30.02 | 42.6,30.02 44.82,30.02 47.5,30 49.63,28.2 U$1.GND@3 | U$1.IN@2 42.73,29.89 42.6,30.02 | 34.3,4.1 v33.9,4.6 33.9,4.2 35.5,2.6 46.21,2.6 46.81,2.5 48.3,1.6 48.4,1.6 | 49.2,20.89 U$1.GND@3 | 39.8,21.3 46.31,20.6 U$1.GND@3 | 49.9,51.52 46.6,53.3 44.06,53.3 GND.1 41.48,52.28 BAT_-.1 38.9,52 v36.9,52.1 | 49.53,37.5 49.53,33.87 53.6,30 53.7,18.8 53.68,18.44 52.8,18.1 52.1,17.9 51.2,18.3 49.2,20.49 U$1.GND@3 | 53.4,1.7 53.17,1.69 51.7,1.6 48.4,1.6 | v53.6,16.7 54.1,14.6 | v48.6,5.5 48.4,1.6
  Bottom 0.27: 7.48,53.6 IC3.5
  Bottom 0.3: 7.8,53.1 7.48,53.6
  Bottom 0.406: C2.2 16.85,30.89 16.85,30.55
  Bottom 0.5: IC1.14 20.95,26.95 20.9,27 | 20.9,27 20.5,27 20.2,27.2 19.5,27.6 17.2,29.7 17.2,30.2 | 20.9,27 27.2,27 29.1,28.9 29.1,30.37 | 29.1,30.37 29.1,31.8 28.4,32.5 27.5,32.5 27.3,32.7 C4.2 | 29.1,30.37 IC1.24 | 33.7,19.8 37.23,19.8 IC1.44 39.08,19.75 C1.2 | IC1.34 39.75,27.75 40.1,28.1 40.1,29.45 C3.2 | C3.2 40.2,28.6 40.3,28.7 40.3,29.3 40.43,29.97 40.13,30.02 C3.2 | C5.2 33.08,12.92 IC1.52 33.08,12.82 33.3,12.6 35.3,12.6 36.1,13.4 36.2,13.4 38.9,16.1 40.2,16.1 40.7,16.6 40.7,19.7 40.3,20.1 C1.2 | v39,21.3 39,20.13 C1.2
  Bottom 0.7: 29.1,28.9 29.1,27.7 30.3,26.5
  Bottom 0.813: 40.13,30.02 40.63,30.73 41,31.3 47.8,31.3 48.8,30.3 48.8,26.7 C8.-
  Bottom 0.9: JP1.6 31.13,4.57 v33.9,4.6 | 30.3,26.5 30.3,23.2 33.7,19.8 | 7.8,53.1 9.9,52 10.3,52.1 | 26.13,51.74 27.2,53.7 28.7,53.7 27.4,53.6 29.9,53.7 | 26.13,51.74 24.3,50.9 21.3,48.7 17.8,48.7 15.5,50.1 13.7,50.1 13.4,50.8 13,51.5 12.3,52.1 10.3,52.1 | 9.1,46.32 R12.1 9.35,46.25 10.4,46.7 10.3,52.1 | 17.2,30.2 16.85,30.55 16.1,31.3 14.6,31.3 14.3,31.6 13.8,31.6 13.8,33 12.9,33.9 10.6,34 8.97,34.47 IC4.1 8.5,34.73 8.5,35.9 7.1,37.3 4.5,37.3 3.5,38.6 3.6,42.2 3.77,42.77 C15.2 3.84,43.62 R14.1 | C28.2 25.31,45.21 27.1,47 28.09,47 C16.- | C16.- 33.78,47.17 C29.- 36.88,47.28 37.3,46.9 37.5,46.1 37.5,44.1 38.5,43.1 C12.- | 28.6,47.51 C16.- | v36.9,52.1 32.7,53.7 29.9,53.7 | 29.9,53.7 29.9,48.9 28.2,47.23 C16.- | 49.43,26.27 49.83,26.45 50.48,24.5 50.48,20.18 48.3,19.1 48,17.3 48.7,16.3 49.7,16.2 53.6,16.2 v53.6,16.7 | 49.43,26.27 48.25,26.45 | X2.2 48.75,6.85 v48.6,5.5 | C8.- 49.41,26.25 49.43,26.27 | C9.2 25.17,51.3 26.13,51.74
  pour Bottom (isolate 0.61): -0.2,56 55.4,56.9 55.6,0.2 0.4,0.3
  pour Top (isolate 0.61): 56.4,56 55.7,0.3 55.6,0.2 0.4,0.1 1.1,54.9
GS
  Bottom 0.5: IC1.10 20.15,23.75 18.5,22.4 15.4,22.4
  Bottom 0.9: X4.4 10.84,27.86 14.7,23.6 15.4,22.4
MISO  (via drill 1)
  Top 0.9: 36.9,27.6 36.6,27.6 35.1,26.2 34.7,25.82 R8.2 34.89,20.21 36.8,19.7 47.7,18.4 v49.6,17.9
  Top 1: 36.9,27.6 39.65,27.6 U$1.DOUT
  Bottom 0.5: IC1.32 35.48,30.58 36,31.1
  Bottom 0.9: v49.6,17.9 51.2,17.8 51.7,17.8 52.6,18 53.6,18.9 53.6,32.5 52.3,34.9 49.6,36.9 38.7,37.3 36,32.2 36,31.1
MOSI  (via drill 1)
  Top 0.9: U$1.DIN 42.62,40.02 42.5,49.3 v45.5,51.7
  Bottom 0.5: IC1.31 34.68,32.98 34.8,33.1
  Bottom 0.9: v45.5,51.7 45.1,44.2 44.5,40.7 | 34.8,33.1 34.8,37.54 R6.2
  Bottom 1: R6.2 43.36,39.46 44.5,40.7
N$1  (via drill 3)
  other vias: 19.7,4
N$2  (via drill 3)
  other vias: 19.7,52
N$3
  Bottom 0.27: IC3.7 6.83,48.23
  Bottom 0.3: 6.83,48.23 6.8,47.9
  Bottom 0.5: 6.8,47.9 6.9,47.7 6.4,46.9
  Bottom 0.9: 6.4,46.9 6.4,46.47 R13.2
N$4
  Bottom 0.9: X16.1 14.65,39.2 R10.2
N$6
  Bottom 0.9: R13.1 8.36,42.99 LED3.K
N$7
  Bottom 0.27: IC3.3 6.33,54.47
  Bottom 0.3: 6.33,54.47 6.2,54.5
  Bottom 0.5: 6.2,54.5 4.7,54.48 R11.2
N$8  (via drill 1)
  Top 0.9: v3.6,52 9.8,52.1 v11.9,50.3
  Bottom 0.9: R11.1 1.73,52.17 v3.6,52 | v11.9,50.3 12.2,47.87 LED2.K
N$9  (via drill 1)
  Top 0.9: v4.8,8.6 2.9,10.4 2.92,11.9 R4.1
  Bottom 0.5: 6.6,13.5 7.1,14.8 IC2.12
  Bottom 0.9: 5,8.9 v4.8,8.6 5.24,8.84 R3.2 6.86,9.19 C11.1 6.6,11.94 6.6,13.5
N$10
  Bottom 0.27: IC3.6 7.53,49.57
  Bottom 0.3: 7.53,49.57 7.7,49.2
  Bottom 0.9: 7.7,49.2 8.4,48.48 R12.2
N$11
  Bottom 0.27: IC3.8 6.33,48.73 6.1,48.2
  Bottom 0.5: 6.1,48.2 5.6,47.9
  Bottom 0.7: 5.6,47.9 5.3,47.9
  Bottom 0.9: 5.3,47.9 4.69,47.8 R14.2
N$12  (via drill 1)
  Top 0.9: v14.4,48.5 v14.8,51.8
  Bottom 0.9: LED1.K 16.18,47.82 15.4,48.1 v14.4,48.5 | v14.8,51.8 12.74,53.6 R5.1
N$13
  Bottom 0.27: IC3.4 6.83,54.33
  Bottom 0.3: 6.83,54.33 7.6,54.6
  Bottom 0.5: 7.6,54.6 9,54.2
  Bottom 0.9: 9,54.2 9.7,54.2 R5.2
OG  (via drill 1)
  Top 0.9: v19.6,16.2 20.8,16.7 20.8,21.5 19.2,22.9 19.2,24.8 18.3,27.2 v15.7,29.3
  Bottom 0.5: IC1.13 20.55,26.15 19,26.6
  Bottom 0.7: 19,26.6 v15.7,29.3
  Bottom 0.9: X3.5 13.4,4.1 14.5,5.4 14.6,5.5 14.6,14.4 15.1,14.7 15.3,14.9 16.7,16 v19.6,16.2
PDI_CLK/RESET
  Bottom 0.5: IC1.57 29.08,12.68 28.7,12.3 28.7,12.2 26.3,10.2
  Bottom 0.9: R2.1 37.69,2.9 34.8,2.9 33.81,2.81 29.28,2.81 JP1.5 26.3,6.61 26.3,10.2
PDI_DATA
  Bottom 0.5: 29.9,12 29.9,14.73 IC1.56
  Bottom 0.9: JP1.1 29.29,10.19 29.9,12
SCK  (via drill 1)
  Top 0.9: R7.2 23.3,33.9 24.6,32.6 24.47,32.57 39.73,32.57 U$1.CLK 47.18,32.52 51.8,28.6 52.1,23.5 52.1,20.47 52.43,20.13 | 52.4,20.1 52.43,20.13 | 52.43,20.13 v52.1,19.9
  Bottom 0.5: IC1.33 37.65,28.55 38.1,30
  Bottom 0.9: 38.1,30 38.2,32.5 39.7,35.5 48.7,35.4 52,31.3 v52.1,19.9
SD_IN  (via drill 1)
  Top 0.9: v15.5,33.1 15.9,31.5 19.7,28 21.5,25.35 U$1.P$2
  Top 1: R54.2 23.95,22.2 U$1.P$2
  Bottom 0.5: IC1.29 33.08,32.42 32.2,33.6
  Bottom 0.9: 32.2,33.6 31.8,34.1 29.7,36.3 23,36.3 v15.5,33.1
SL  (via drill 1)
  Top 0.9: v12.9,13.5 15.7,14.7 18.8,17.7 19,20.4 17.5,22.3 v17.3,25.8
  Bottom 0.5: IC1.12 20.85,25.35 18.9,25.4
  Bottom 0.7: v17.3,25.8 18.9,25.4
  Bottom 0.9: X3.4 10.84,4.24 13,6.9 13,11.6 v12.9,13.5
SS  (via drill 1)
  Top 0.9: U$1./CS 36.98,42.42 34.2,48.7 26.2,48.79 | 26.2,48.79 26,48.79 | R9.2 24.24,46.9 26.05,48.7 26.12,48.7 26.2,48.79
  Top 1: 26,48.79 26.31,49.29 v28.1,51.7
  Bottom 0.5: IC1.30 33.88,32.92 32.9,36.2
  Bottom 0.9: 32.9,36.2 31,37.7 22.9,37.7 20,38.1 19.4,42
  Bottom 1: v28.1,51.7 25.7,48.2 23.7,48.2 21.3,46.8 19.4,42
ST
  Bottom 0.5: IC1.11 19.35,24.55 17.9,24
  Bottom 0.9: X4.5 13.38,28.42 16.3,24 17.9,24
VCC  (via drill 1)
  Top 0.9: 27.02,35 U$1.3V3 37.18,35.02 | 27.02,35 24.9,37.32 R7.1 16.58,38 15.7,36.9 15.6,36.4 15.8,36.3 | R8.1 34.69,17.11 35,17.5 35.6,17.5 36.78,17.49 40.1,17.4 47.6,16.6 51.2,16.1 52.6,14.8 53.2,9.9 53.04,8.5 | R54.1 26.85,23.95 24.9,25.7 21.8,27.9 18.3,31.6 18,32.1 16.4,34.5 15.8,36.3 | 12.02,36.78 12.7,36.09 | 12.7,36.09 v11.6,38.7 12.1,36 15.8,36.3 | R9.1 20.71,43.89 v21.4,41.7 21.4,41.6 24.4,40.1 24.4,38.08 27.02,35 | v51.3,3.1 52.29,6.71 | 52.29,6.71 52.68,7.7 | 52.68,7.7 53.04,8.5 | 52.68,7.7 53.03,8.6 53.04,8.5 | 12.7,36.09 13.1,36.1 13.4,36 13.3,31.8 v4,32 3.9,32.1 2.2,32.1 1.6,31.5 1.6,21.6 2.92,20.28 R4.2 | 52.3,6.7 52.29,6.71
  Top 1: R54.1 30.58,18.42 R8.1
  Bottom 0.9: JP1.2 34.54,6.28 | 34.54,6.28 38.95,6.25 41.55,3.65 R16.2 R15.2 49,3.5 50.6,3.1 v51.3,3.1 | R10.1 12.15,37.1 v11.6,38.7 9.7,39.1 7.5,39.9 IC4.4 | C28.1 23.6,43.21 | 23.6,43.21 23.11,42.81 v21.4,41.7 | 23.6,43.21 24.04,42.77 C16.+ 28.37,42.88 C29.+ | v4,32 5.46,31.9 C10.1 | R2.2 37.75,5.97 34.54,6.28 | 51.22,3.08 v51.3,3.1 | v51.3,3.1 51.2,4.9 | 51.2,4.9 51.2,5.18 L1.1 | X2.1 52.69,8.89 50.9,7.1 50.9,5.2 51.2,4.9
  Bottom 1: v21.4,41.7 23.5,39.7 24.02,39.52 R6.1
VREF  (via drill 1)
  Top 0.9: v4.9,13 8.4,8.4 14.4,8.3 15.5,7 v16.1,6.4
  Bottom 0.5: IC1.62 25.08,13.78 24.2,13.4
  Bottom 0.61: 16.1,13.6 arc-58 17.1,14.7 20.1,14.7 21.2,13.4 24.2,13.4
  Bottom 0.7: IC2.14 5,15.57 IC2.13
  Bottom 0.9: 16.1,13.6 v16.1,6.4 | v4.9,13 5,15.57
X
  Bottom 0.7: 4.4,24.5 5.7,23.4 7.1,22 7.1,20.82 IC2.3
  Bottom 0.9: X3.1 2.02,5.58 2,13.2 2,21.4 2.1,23.6 2.7,24.5 4.4,24.5
Y
  Bottom 0.7: IC2.5 9.59,19.59 7.8,17.8 4.2,17.8 3.4,17.1 3.4,7.6 3.9,6.9
  Bottom 0.9: 3.9,6.9 5.8,5 5.8,4.14 X3.2
Z
  Bottom 0.7: IC2.10 9.79,14.21 10.5,11.8 11.5,10.8
  Bottom 0.9: 11.5,10.8 11.5,7.6 11,6.9 9.9,6.7 8.3,5.2 X3.3